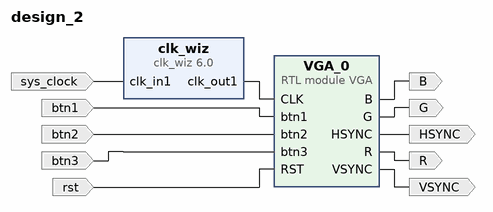
[diagram p0: block diagram of the top level]
# Vivado block design design_2, xc7z020clg400-1, Vivado 2023.1
create_bd_design design_2

create_bd_port -dir I -type clk sys_clock
set_property -dict {CONFIG.FREQ_HZ 125000000 CONFIG.PHASE 0.0} [get_bd_ports sys_clock]
create_bd_port -dir O HSYNC
create_bd_port -dir O VSYNC
create_bd_port -dir O R
create_bd_port -dir O G
create_bd_port -dir O B
create_bd_port -dir I rst
create_bd_port -dir I btn1
create_bd_port -dir I btn2
create_bd_port -dir I btn3

create_bd_cell -type ip -vlnv xilinx.com:ip:clk_wiz:6.0 clk_wiz
set_property -dict [list \
  CONFIG.CLKOUT1_JITTER 143.688 \
  CONFIG.CLKOUT1_REQUESTED_OUT_FREQ 50 \
  CONFIG.CLK_IN1_BOARD_INTERFACE sys_clock \
  CONFIG.MMCM_CLKOUT0_DIVIDE_F 20.000 \
  CONFIG.USE_BOARD_FLOW true \
] [get_bd_cells clk_wiz]
create_bd_cell -type module -reference VGA VGA_0

# ---- connections ----

connect_bd_net [get_bd_pins VGA_0/B] [get_bd_ports B]
connect_bd_net [get_bd_pins VGA_0/G] [get_bd_ports G]
connect_bd_net [get_bd_pins VGA_0/HSYNC] [get_bd_ports HSYNC]
connect_bd_net [get_bd_pins VGA_0/R] [get_bd_ports R]
connect_bd_net [get_bd_pins VGA_0/VSYNC] [get_bd_ports VSYNC]
connect_bd_net -net btn1_1 [get_bd_ports btn1] [get_bd_pins VGA_0/btn1]
connect_bd_net -net btn2_1 [get_bd_ports btn2] [get_bd_pins VGA_0/btn2]
connect_bd_net -net btn3_1 [get_bd_ports btn3] [get_bd_pins VGA_0/btn3]
connect_bd_net [get_bd_pins clk_wiz/clk_out1] [get_bd_pins VGA_0/CLK]
connect_bd_net [get_bd_ports rst] [get_bd_pins VGA_0/RST]
connect_bd_net [get_bd_ports sys_clock] [get_bd_pins clk_wiz/clk_in1]

validate_bd_design
save_bd_design
